# EAGLE design comms 2 (EAGLE 9.5.2)
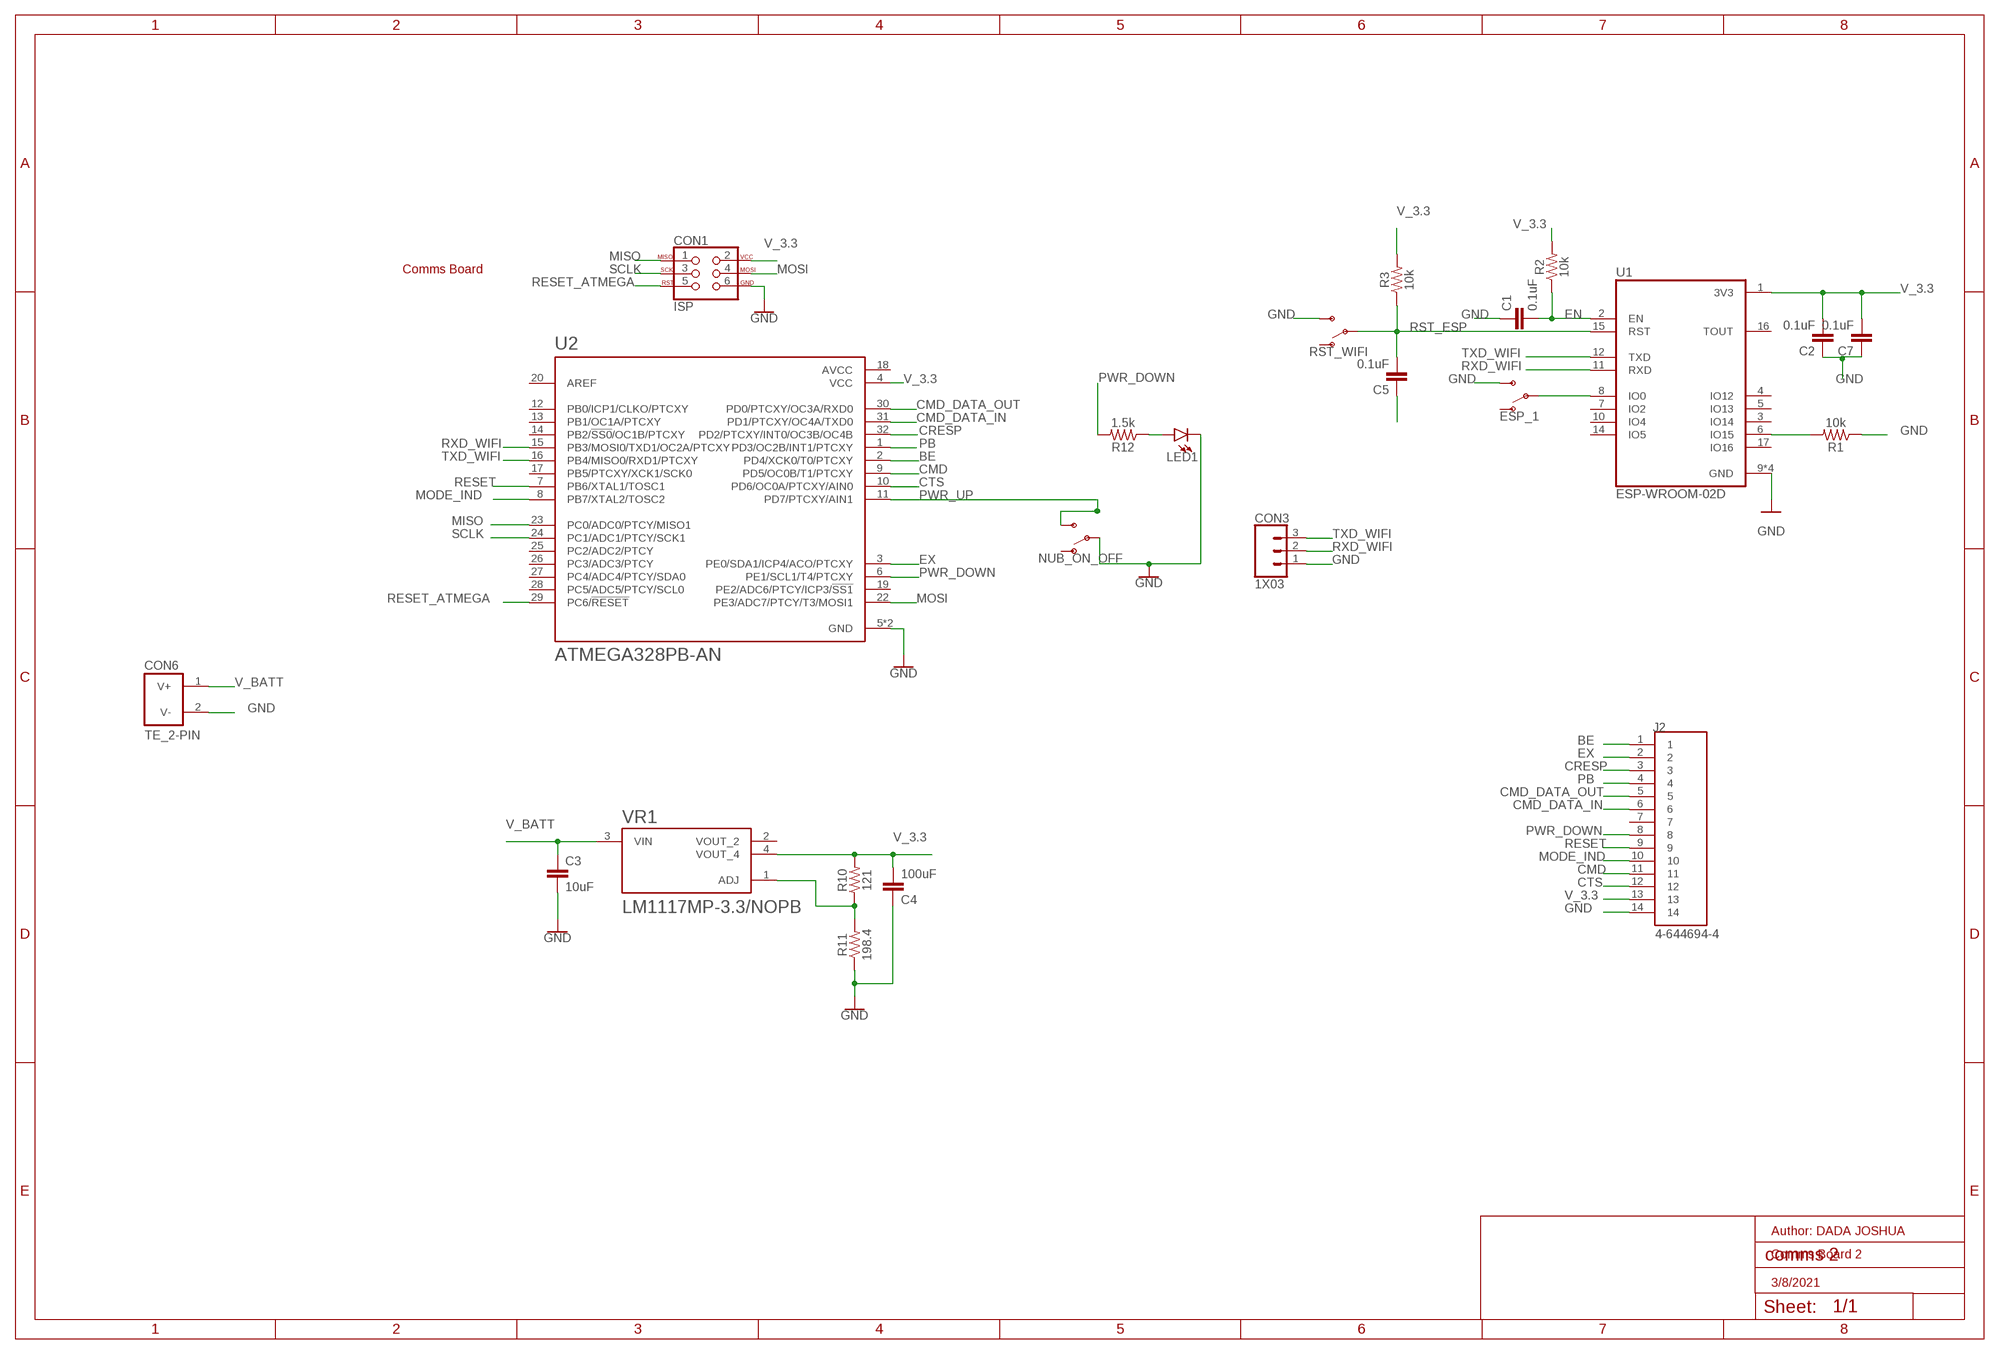
[diagram p0: schematic, sheet 1]

## Parts
C1  0.1uF  CAPACITOR_1210  [1210]
C2  0.1uF  CAPACITOR_1210  [1210]
C3  10uF  CAPACITOR_1210  [1210]
C4  100uF  CAPACITOR_1210  [1210]
C5  0.1uF  CAPACITOR_1210  [1210]
C7  0.1uF  CAPACITOR_1210  [1210]
CON1  ISP  [ISP_CONNECTOR]
CON3  1X03  [1X03]
CON6  TE_2-PIN  [TE_2-PIN]
ESP_1  SWITCH_SPDT  [SWITCH_SPDT]
J2  4-644694-4  [TE_4-644694-4]
LED1  LED_THROUGH-HOLE  [LED_THROUGH-HOLE]
NUB_ON_OFF  SWITCH_SPDT  [SWITCH_SPDT]
R1  10k  RESISTOR_1210  [1210]
R2  10k  RESISTOR_1210  [1210]
R3  10k  RESISTOR_1210  [1210]
R10  121  RESISTOR_1210  [1210]
R11  198.4  RESISTOR_1210  [1210]
R12  1.5k  RESISTOR_1210  [1210]
RST_WIFI  SWITCH_SPDT  [SWITCH_SPDT]
U1  ESP-WROOM-02D  [MODULE_ESP-WROOM-02D]
U2  ATMEGA328PB-AN  [QFP80P900X900X120-32N]
VR1  LM1117MP-3.3/NOPB  [VREG_LM1117MP-3.3/NOPB]

## Nets
BE: J2.1 U2.2(PD4/XCK0/T0/PTCXY)
CMD: J2.11 U2.9(PD5/OC0B/T1/PTCXY)
CMD_DATA_IN: J2.6 U2.31(PD1/PTCXY/OC4A/TXD0)
CMD_DATA_OUT: J2.5 U2.30(PD0/PTCXY/OC3A/RXD0)
CRESP: J2.3 U2.32(PD2/PTCXY/INT0/OC3B/OC4B)
CTS: J2.12 U2.10(PD6/OC0A/PTCXY/AIN0)
EN: C1.2 R2.1 U1.2(EN)
EX: J2.2 U2.3(PE0/SDA1/ICP4/ACO/PTCXY)
GND: C1.1 C2.1 C3.2 C4.1 C5.1 C7.1 CON1.6 CON3.1 CON6.2(V-) ESP_1.3(S) J2.14 LED1.C NUB_ON_OFF.2(P) R1.1 R11.1 RST_WIFI.3(S) U1.9(GND) U1.13(GND) U1.18(GND) U1.19(GND) U2.5(GND) U2.21(GND)
MISO: CON1.1 U2.23(PC0/ADC0/PTCY/MISO1)
MODE_IND: J2.10 U2.8(PB7/XTAL2/TOSC2)
MOSI: CON1.4 U2.22(PE3/ADC7/PTCY/T3/MOSI1)
N$3: R10.1 R11.2 VR1.1(ADJ)
N$8: R1.2 U1.6(IO15)
N$10: LED1.A R12.1
N$12: ESP_1.2(P) U1.8(IO0)
PB: J2.4 U2.1(PD3/OC2B/INT1/PTCXY)
PWR_DOWN: J2.8 R12.2 U2.6(PE1/SCL1/T4/PTCXY)
PWR_UP: NUB_ON_OFF.3(S) U2.11(PD7/PTCXY/AIN1)
RESET: J2.9 U2.7(PB6/XTAL1/TOSC1)
RESET_ATMEGA: CON1.5 U2.29(PC6/!RESET)
RST_ESP: C5.2 R3.1 RST_WIFI.2(P) U1.15(RST)
RXD_WIFI: CON3.2 U1.11(RXD) U2.15(PB3/MOSI0/TXD1/OC2A/PTCXY)
SCLK: CON1.3 U2.24(PC1/ADC1/PTCY/SCK1)
TXD_WIFI: CON3.3 U1.12(TXD) U2.16(PB4/MISO0/RXD1/PTCXY)
V_3.3: C2.2 C4.2 C7.2 CON1.2 J2.13 R2.2 R3.2 R10.2 U1.1(3V3) U2.4(VCC) VR1.4(VOUT_4)
V_BATT: C3.1 CON6.1(V+) VR1.3(VIN)
Unconnected: ESP_1.1(O) J2.7 NUB_ON_OFF.1(O) RST_WIFI.1(O) U1.3(IO14) U1.4(IO12) U1.5(IO13) U1.7(IO2) U1.10(IO4) U1.14(IO5) U1.16(TOUT) U1.17(IO16) U2.12(PB0/ICP1/CLKO/PTCXY) U2.13(PB1/OC1A/PTCXY) U2.14(PB2/!SS0!/OC1B/PTCXY) U2.17(PB5/PTCXY/XCK1/SCK0) U2.19(PE2/ADC6/PTCY/ICP3/!SS1) U2.20(AREF) U2.25(PC2/ADC2/PTCY) U2.26(PC3/ADC3/PTCY) U2.27(PC4/ADC4/PTCY/SDA0) U2.28(PC5/ADC5/PTCY/SCL0) VR1.2(VOUT_2)

## Notes on the sheet
- Comms Board
- Author: DADA JOSHUA
- Comms Board 2
- 3/8/2021

## Power pins joined to a net without a drawn wire
AVCC: U2.18(AVCC)

## Library data of the parts
C1-C5 C7 = EcoCar-Passives:CAPACITOR_1210
CON1 = EcoCar-Microcontrollers:ISP: ISP Header Use for programming microcontrollers such as the 328P
CON3 = EcoCar-Connectors-2.54mm:1X03: 2.54mm (0.1") Header
CON6 = EcoCar-Connectors:TE_2-PIN: 2 Pin TE Mini-Universal MATE-N-LOK - Use for signals and power connections Part Number: 1-770966-0 Digikey Part Number: A32471-ND Matching Plug: A25587-ND Matching Crimps: A100828CT-ND
ESP_1 NUB_ON_OFF RST_WIFI = EcoCar-Electromechanical:SWITCH_SPDT: SPDT Switch Manufacturer: C&K Part Number: OS102011MS2QN1 Digikey Part Number: CKN9565-ND
J2 = 4-644694-4:4-644694-4; CENTERLINE_PITCH: 2.54 mm[.1 in]; COMMENT: 4-644694-4; DESCRIPTION: 14P MTA100 R/A HDR RETENTIVE; DIGI-KEY_PART_NUMBER: A30868-ND; EU_ROHS_COMPLIANCE: Compliant; MF: TE Connectivity; MP: 4-644694-4; NUMBER_OF_POSITIONS: 14; PACKAGE: None; PRODUCT_TYPE: Connector; PURCHASE-URL: https://pricing.snapeda.com/search/part/4-644694-4/?ref=eda
LED1 = EcoCar-Discrete-Semiconductors:LED_THROUGH-HOLE
R1-R3 R10-R12 = EcoCar-Passives:RESISTOR_1210
U1 = ESP-WROOM-02D:ESP-WROOM-02D: WiFi 802.11b/g/n Transceiver Module 2.4GHz ~ 2.5GHz Integrated, Trace Surface Mount; AVAILABILITY: Unavailable; DESCRIPTION: WiFi 802.11b/g/n Transceiver Module 2.4GHz ~ 2.5GHz Integrated, Trace Surface Mount; MF: Espressif Systems; MP: ESP-WROOM-02D; PACKAGE: SMD-18 Espressif Systems; PRICE: None
U2 = ATMEGA328PB-AN:ATMEGA328PB-AN: AVR microcontroller; EEPROM: 1024B; SRAM: 2kB; Flash: 32kB; TQFP32 Check prices <https://pricing.snapeda.com/parts/ATMEGA328PB-AN/Microchip/view-part?ref=eda>; AVAILABILITY: Good; DESCRIPTION: AVR AVR® ATmega, Functional Safety (FuSa) Microcontroller IC 8-Bit 20MHz 32KB (16K x 16) FLASH; MF: Microchip; MP: ATMEGA328PB-AN; PACKAGE: TQFP-32 Microchip; PRICE: None; PURCHASE-URL: https://pricing.snapeda.com/search/part/ATMEGA328PB-AN/?ref=eda
VR1 = LM1117MP-3.3_NOPB:LM1117MP-3.3/NOPB: 800-mA 15-V linear voltage regulator 4-SOT-223 0 to 125 Check prices <https://pricing.snapeda.com/parts/LM1117MP-3.3/NOPB/Texas%20Instruments/view-part?ref=eda>; AVAILABILITY: Warning; DESCRIPTION: 800-mA 15-V linear voltage regulator 4-SOT-223 0 to 125; MF: Texas Instruments; MP: LM1117MP-3.3/NOPB; PACKAGE: SOT-223-4 Texas Instruments; PRICE: None; PURCHASE-URL: https://pricing.snapeda.com/search/part/LM1117MP-3.3/NOPB/?ref=eda

## Board
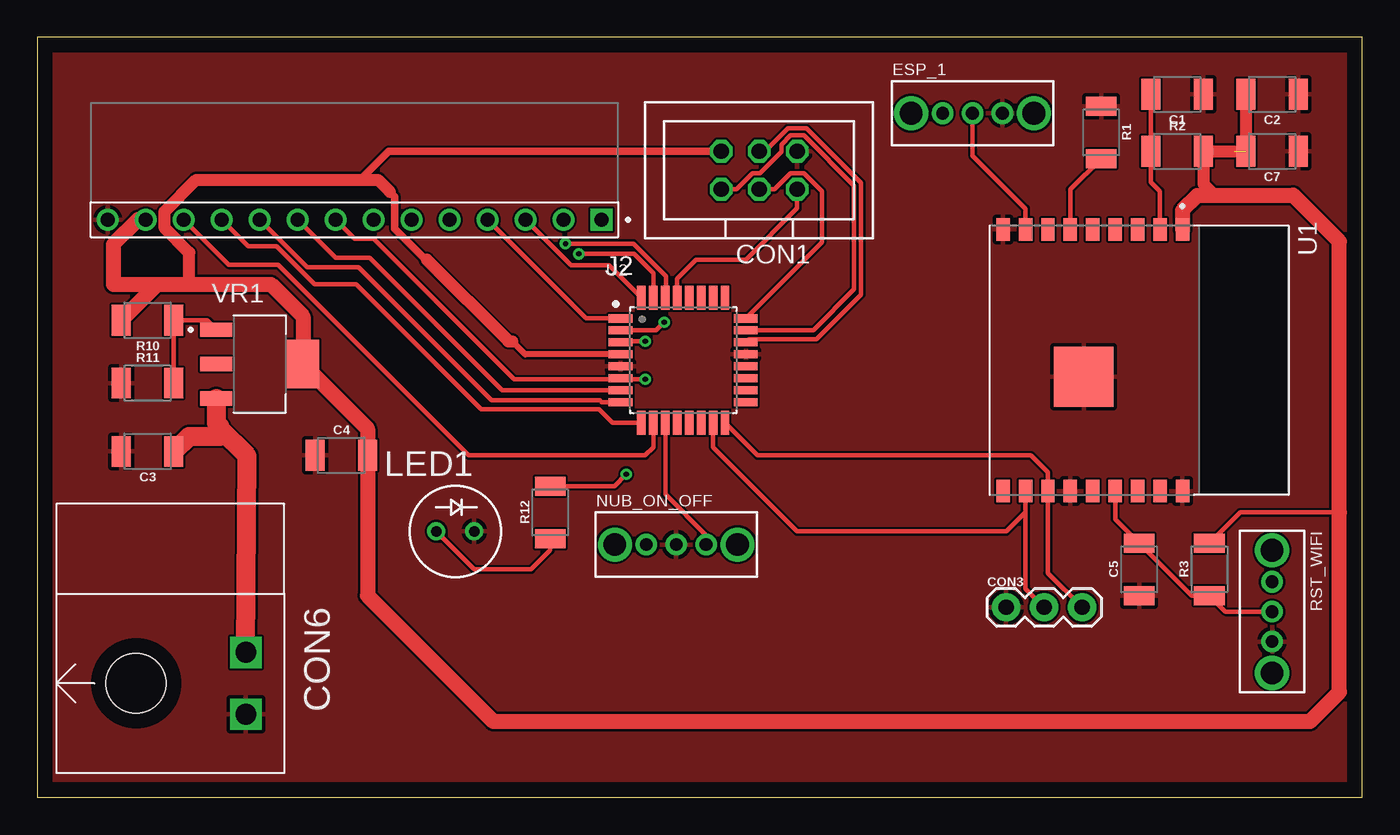
[diagram p1: board, top side]
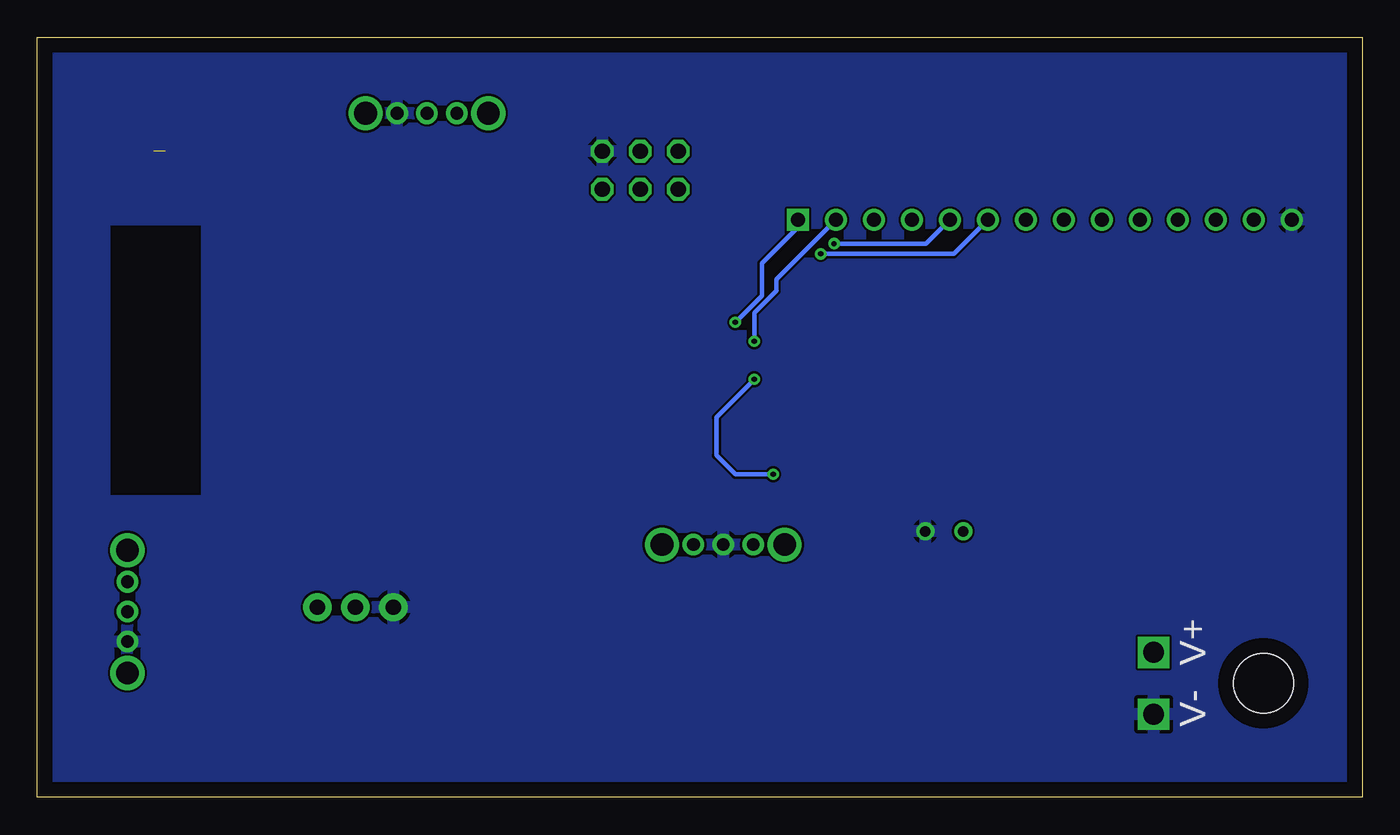
[diagram p2: board, bottom side, seen from below]

Size 88.57 x 50.79 mm. Coordinates in mm from the lower left corner, seen from the top.
Outline: 0,0 88.57,0 88.57,50.79 0,50.79 0,0
Copper layers (1*16): Top 0.035mm / dielectric 1.5mm / Bottom 0.035mm
Design rules "default": minimum track width 6mil, minimum drill 0.35mm, track to track 6mil, track to pad 6mil, pad to pad 6mil, via to via 6mil, smd to smd 6mil, copper to edge 40mil, drill to drill 6mil, minimum pad ring 10mil, minimum via ring 8mil, stop-mask expansion 4mil, vias tented up to drill 0mil, thermal gap 10mil

### Footprints (pad centres in the part's own frame; a part is rotated, then mirrored left to right if it is on the bottom)
1210 = smd 1.27 x 2.06: 1 -1.755,0; 2 1.755,0
ISP_CONNECTOR = drill 1.016 octagon: 1 2.54,1.27; 2 2.54,-1.27; 3 0,1.27; 4 0,-1.27; 5 -2.54,1.27; 6 -2.54,-1.27
1X03 = drill 1.016 pad 1.88: 1 0,0; 2 2.54,0; 3 5.08,0
TE_2-PIN = drill 1.4 square: 1 -2.07,12.67; 2 2.07,12.67 | hole 4: 0,5.33
SWITCH_SPDT = drill 0.85 pad 1.445: 1 2.1,0; 2 4.1,0; 3 6.1,0 | drill 1.52 pad 2.184: G1 0,0; G2 8.2,0
TE_4-644694-4 = drill 0.94 pad 1.29 square: 1 0,0 | drill 0.94 pad 1.29: 2 2.54,0; 3 5.08,0; 4 7.62,0; 5 10.16,0; 6 12.7,0; 7 15.24,0; 8 17.78,0; 9 20.32,0; 10 22.86,0; 11 25.4,0; 12 27.94,0; 13 30.48,0; 14 33.02,0
LED_THROUGH-HOLE = drill 0.7 pad 1.19: A 0,0; C 2.54,0
MODULE_ESP-WROOM-02D = smd 1.5 x 0.9: 1 -8.75,2.9; 2 -8.75,1.4; 3 -8.75,-0.1; 4 -8.75,-1.6; 5 -8.75,-3.1; 6 -8.75,-4.6; 7 -8.75,-6.1; 8 -8.75,-7.6; 9 -8.75,-9.1; 10 8.75,-9.1; 11 8.75,-7.6; 12 8.75,-6.1; 13 8.75,-4.6; 14 8.75,-3.1; 15 8.75,-1.6; 16 8.75,-0.1; 17 8.75,1.4; 18 8.75,2.9 | smd 4 x 4: 19 1.1,-3.71
QFP80P900X900X120-32N = smd 1.6 x 0.55: 1 -4.18,2.8; 2 -4.18,2; 3 -4.18,1.2; 4 -4.18,0.4; 5 -4.18,-0.4; 6 -4.18,-1.2; 7 -4.18,-2; 8 -4.18,-2.8; 17 4.18,-2.8; 18 4.18,-2; 19 4.18,-1.2; 20 4.18,-0.4; 21 4.18,0.4; 22 4.18,1.2; 23 4.18,2; 24 4.18,2.8 | smd 0.55 x 1.6: 9 -2.8,-4.18; 10 -2,-4.18; 11 -1.2,-4.18; 12 -0.4,-4.18; 13 0.4,-4.18; 14 1.2,-4.18; 15 2,-4.18; 16 2.8,-4.18; 25 2.8,4.18; 26 2,4.18; 27 1.2,4.18; 28 0.4,4.18; 29 -0.4,4.18; 30 -1.2,4.18; 31 -2,4.18; 32 -2.8,4.18
VREG_LM1117MP-3.3/NOPB = smd 2.15 x 0.95: 1 -2.9,2.3; 2 -2.9,0; 3 -2.9,-2.3 | smd 2.15 x 3.25: 4 2.9,0

### Placement (x,y rotation side)
C1  76.2,46.99 180 top
C2  82.55,46.99 180 top
C3  7.37,23.11 180 top
C4  20.32,22.86 0 top
C5  73.66,15.24 90 top
C7  82.55,43.18 180 top
CON1  48.26,41.91 180 top
CON3  64.77,12.7 0 top
CON6  1.27,7.62 270 top
ESP_1  58.42,45.72 0 top
J2  37.72,38.61 180 top
LED1  26.67,17.78 0 top
NUB_ON_OFF  38.61,16.89 0 top
R1  71.12,44.45 270 top
R2  76.2,43.18 0 top
R3  78.36,15.24 90 top
R10  7.37,31.88 180 top
R11  7.37,27.69 0 top
R12  34.29,19.05 90 top
RST_WIFI  82.55,16.51 270 top
U1  73.66,29.21 270 top
U2  43.18,29.21 0 top
VR1  14.86,28.96 0 top

### Tracks (layer width: path | path; a pad name or v marks a point on that pad's centre or on a via)
BE  (via drill 0.35)
  Top 0.305: U2.2 41.37,31.21 v41.91,31.75
  Bottom 0.305: v41.91,31.75 40.13,33.53 40.13,35.69 37.72,38.1 J2.1
CMD
  Top 0.305: J2.11 14.1,36.83 15.99,36.83 18.53,34.29 21.32,34.29 29.66,25.95 37.55,25.95 38.47,25.03 U2.9
CMD_DATA_IN  (via drill 0.35)
  Top 0.305: U2.31 41.18,35.02 39.88,36.32 v36.2,36.32
  Bottom 0.305: v36.2,36.32 27.3,36.32 J2.6
CMD_DATA_OUT  (via drill 0.35)
  Top 0.305: U2.30 42.01,33.42 42.01,34.83 39.84,37 v35.31,37
  Bottom 0.305: v35.31,37 29.16,37 J2.5
CRESP
  Top 0.305: J2.3 35.69,35.56 38.21,35.56 U2.32
CTS
  Top 0.305: J2.12 12.78,35.61 16.09,35.61 28.84,22.86 40.64,22.86 41.18,23.4 U2.10
EN
  Top 0.305: U1.2 75.06,40.51 74.44,41.12 R2.1 C1.2
EX  (via drill 0.35)
  Top 0.305: U2.3 39.07,30.48 v40.64,30.48
  Bottom 0.305: v40.64,30.48 40.64,32.37 39.17,33.85 39.17,34.62 J2.2
GND
  pour Bottom: -3.81,58.42 -8.89,53.34 -8.89,-3.81 0,-12.7 92.71,-12.7 99.06,-6.35 99.06,48.26 88.9,58.42
  pour Top: -7.62,53.34 -3.81,57.15 -2.54,58.42 91.44,58.42 97.79,52.07 97.79,49.53 97.79,-3.81 92.71,-8.89 86.36,-8.89 -3.81,-8.89 -7.62,-5.08 -7.62,43.18
MISO
  Top 0.305: CON1.1 46.75,40.64 47.82,41.71 48.3,41.71 49.73,43.14 49.73,43.62 50.36,44.25 51.24,44.25 54.61,40.88 54.61,33.94 51.88,31.21 U2.23
MODE_IND
  Top 0.305: J2.10 18.03,35.43 21.46,35.43 30.36,26.54 37.6,26.54 37.73,26.41 U2.8
MOSI
  Top 0.305: U2.22 47.58,30.63 52.1,30.63 55.07,33.6 55.07,41.07 51.43,44.7 50.17,44.7 48.65,43.18 CON1.4
N$3
  Top 0.305: R11.2 R10.1 11.34,31.88 VR1.1
N$8
  Top 0.305: R1.2 69.06,40.63 U1.6
N$10
  Top 0.305: LED1.A 29.21,15.24 33.02,15.24 34.29,16.51 R12.1
N$12
  Top 0.305: ESP_1.2 62.52,42.89 66.06,39.35 U1.8
PB
  Top 0.305: J2.4 36.7,32.01 U2.1
PWR_DOWN  (via drill 0.35)
  Top 0.305: J2.8 21.21,37.34 22.48,37.34 31.88,27.94 38.93,27.94 U2.6 39.07,27.94 v40.64,27.94 | v39.37,21.59 38.59,20.8 R12.2
  Bottom 0.305: v40.64,27.94 43.18,25.4 43.18,22.86 41.91,21.59 v39.37,21.59
PWR_UP
  Top 0.305: U2.11 41.98,20.25 44.71,17.52 NUB_ON_OFF.3
RESET
  Top 0.305: J2.9 19.94,36.07 22.23,36.07 31.08,27.21 U2.7
RESET_ATMEGA
  Top 0.305: CON1.5 50.8,39.37 47.36,35.93 44.05,35.93 42.78,34.66 U2.29
RST_ESP
  Top 0.305: U1.15 72.06,18.6 C5.2 77.17,13.49 R3.1 79.43,12.41 RST_WIFI.2
RXD_WIFI
  Top 0.305: U2.15 45.18,23.4 50.8,17.78 64.78,17.78 66.06,19.06 U1.11 66.06,13.95 CON3.2
SCLK
  Top 0.305: CON1.3 49.29,40.64 50.36,41.71 51.24,41.71 52.44,40.51 52.44,37.09 U2.24
TXD_WIFI
  Top 0.305: U2.16 48.15,22.86 66.43,22.86 67.56,21.73 U1.12 67.56,14.99 CON3.3
V_3.3  (1 unrouted)
  Top 0.305: R3.2 80.41,19.05 87.05,19.05
  Top 0.406: U2.4 32.62,29.61 31.75,30.48
  Top 0.508: 23.58,40.47 23.89,40.16 23.89,38.01 25.96,35.94 26.04,35.94 | 21.59,41.27 23.5,43.18 CON1.2
  Top 0.813: 10.16,34.29 10.16,36.41 8.5,38.08 8.5,39.14 10.63,41.27 21.59,41.27 22.77,41.27 23.58,40.47 | 26.04,35.94 31.5,30.48 31.75,30.48 | 78.74,40.22 77.95,41 R2.2 80.01,43.18 | C2.2 C7.2
  Top 1.016: R10.2 8.02,34.29 | 8.02,34.29 5.08,34.29 5.08,36.96 6.73,38.61 J2.13 | 8.02,34.29 10.16,34.29 15.62,34.29 17.76,32.15 VR1.4 22.07,24.64 C4.2 22.07,13.49 30.48,5.08 85.09,5.08 87.05,7.04 87.05,19.05 87.05,37.16 83.97,40.24 83.94,40.22 78.74,40.22 77.55,40.22 76.56,39.23 U1.1
V_BATT
  Top 1.27: CON6.1 14.01,22.82 12.19,24.64 | VR1.3 11.96,25 12.19,24.77 12.19,24.64 | 12.19,24.64 12.19,24.13 10.14,24.13 C3.1